# EAGLE schematic Graphics_Card_100px_x_75px (EAGLE 9.4.2)
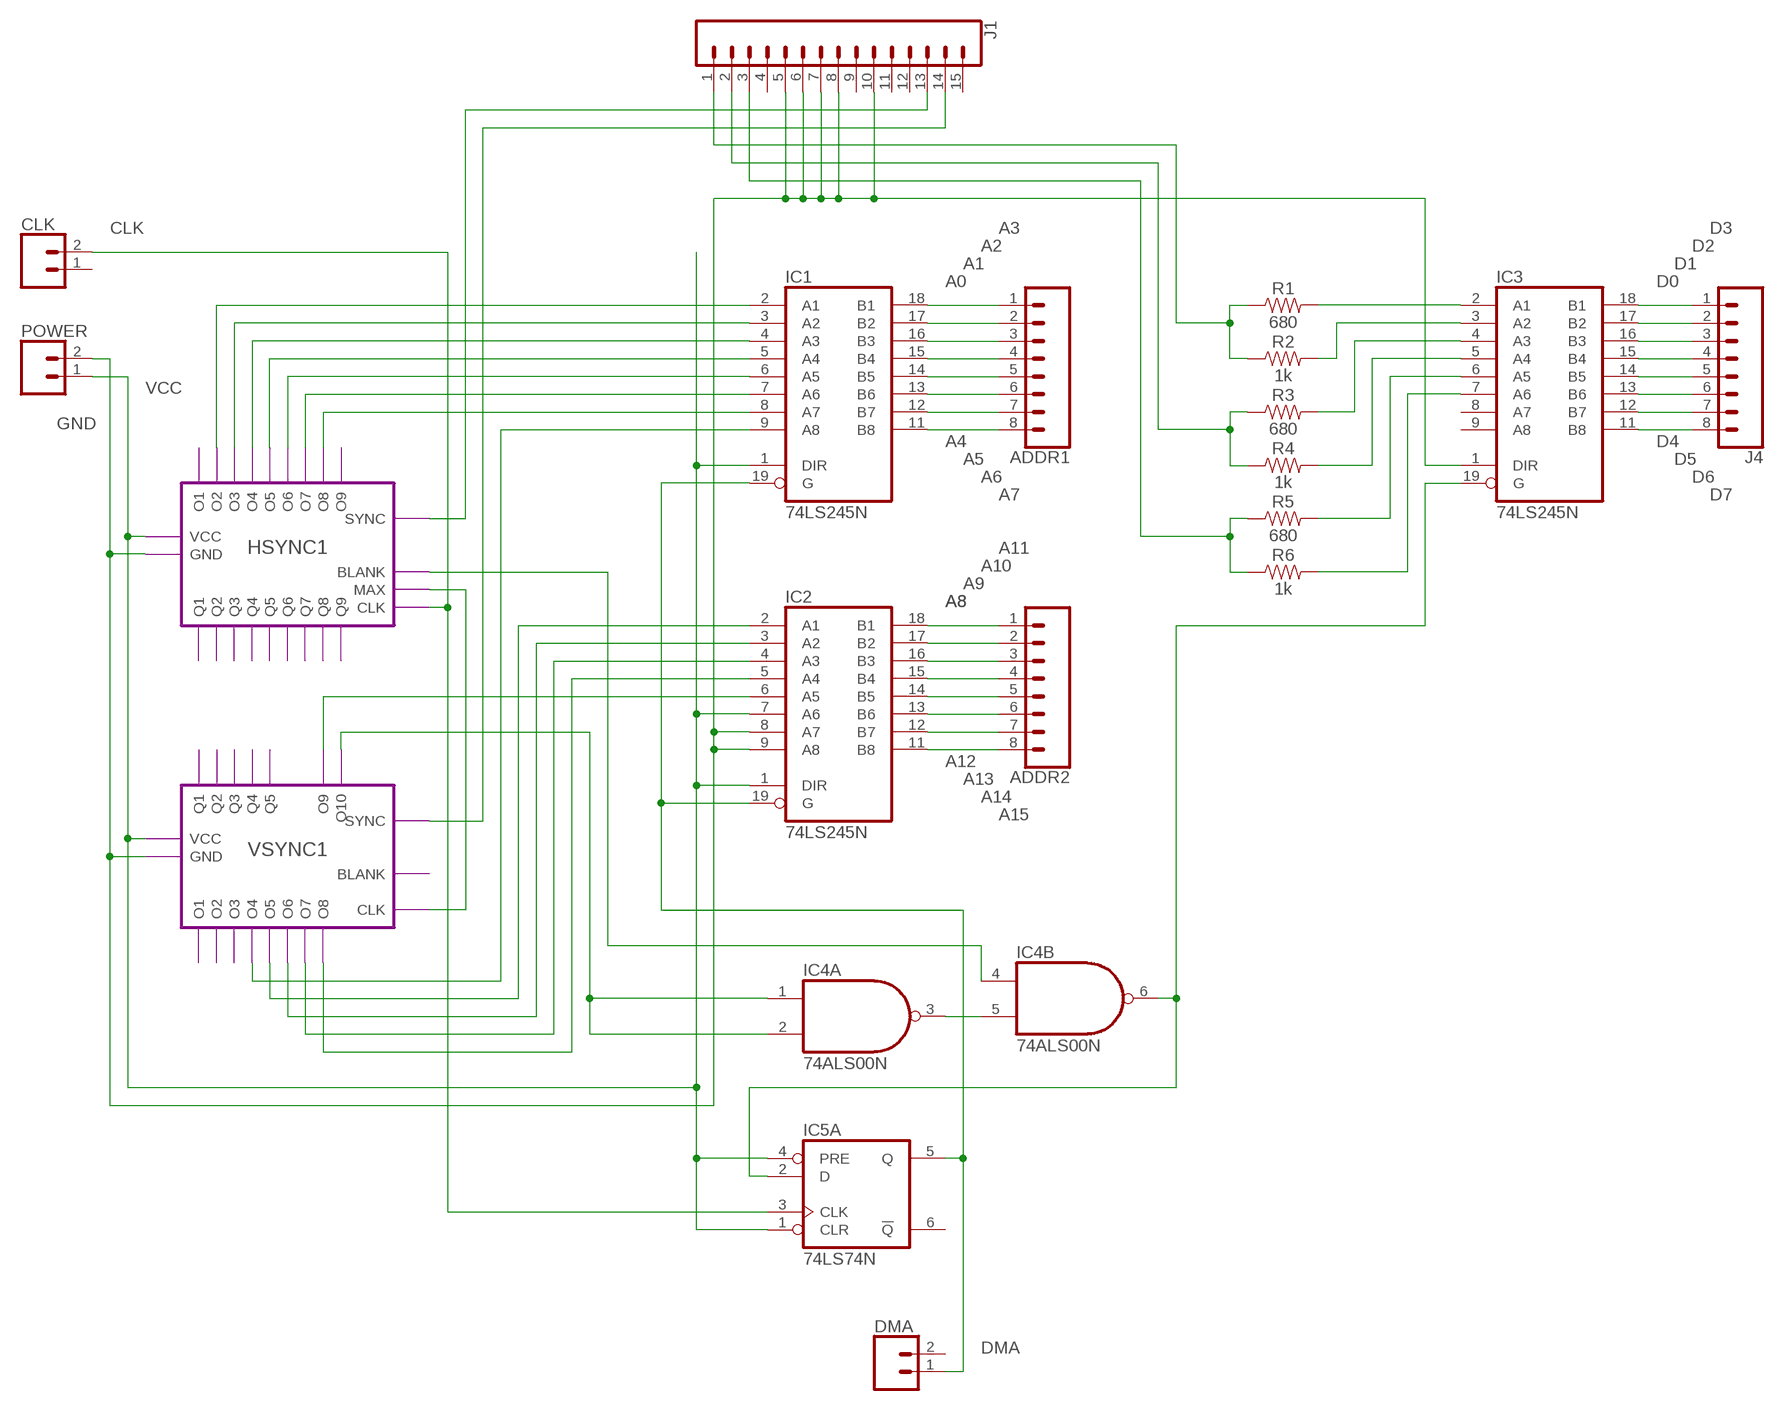
[diagram p0: schematic, sheet 1]

## Parts
ADDR1  CONN_08"  [1X08]
ADDR2  CONN_08"  [1X08]
CLK  CONN_02POGO_PIN_HOLES_ONLY  [1X02_PP_HOLES_ONLY]
DMA  CONN_02POGO_PIN_HOLES_ONLY  [1X02_PP_HOLES_ONLY]
IC1  74LS245N  [DIL20]
IC2  74LS245N  [DIL20]
IC3  74LS245N  [DIL20]
IC4  74ALS00N  [DIL14]
IC5  74LS74N  [DIL14]
J1  CONN_15  [1X15]
J4  CONN_08"  [1X08]
POWER  CONN_02POGO_PIN_HOLES_ONLY  [1X02_PP_HOLES_ONLY]
R1  680  680OHM-0603-1/10W-5%  [0603]
R2  1k  1KOHM-0603-1/10W-1%  [0603]
R3  680  680OHM-0603-1/10W-5%  [0603]
R4  1k  1KOHM-0603-1/10W-1%  [0603]
R5  680  680OHM-0603-1/10W-5%  [0603]
R6  1k  1KOHM-0603-1/10W-1%  [0603]

## Module instances
HSYNC1 = HSYNC
VSYNC1 = VSYNC

## Nets
A0: ADDR1.1 IC1.18(B1)
A1: ADDR1.2 IC1.17(B2)
A2: ADDR1.3 IC1.16(B3)
A3: ADDR1.4 IC1.15(B4)
A4: ADDR1.5 IC1.14(B5)
A5: ADDR1.6 IC1.13(B6)
A6: ADDR1.7 IC1.12(B7)
A7: ADDR1.8 IC1.11(B8)
A8: ADDR2.1 IC2.18(B1)
A9: ADDR2.2 IC2.17(B2)
A10: ADDR2.3 IC2.16(B3)
A11: ADDR2.4 IC2.15(B4)
A12: ADDR2.5 IC2.14(B5)
A13: ADDR2.6 IC2.13(B6)
A14: ADDR2.7 IC2.12(B7)
A15: ADDR2.8 IC2.11(B8)
CLK: CLK.2 IC5.3(A:CLK) ; port HSYNC1.CLK
D0: IC3.18(B1) J4.1
D1: IC3.17(B2) J4.2
D2: IC3.16(B3) J4.3
D3: IC3.15(B4) J4.4
D4: IC3.14(B5) J4.5
D5: IC3.13(B6) J4.6
D6: IC3.12(B7) J4.7
D7: IC3.11(B8) J4.8
DMA: DMA.1 IC1.19(G) IC2.19(G) IC5.5(A:Q)
GND: IC2.8(A7) IC2.9(A8) IC3.1(DIR) J1.5 J1.6 J1.7 J1.8 J1.10 POWER.2 ; port HSYNC1.GND VSYNC1.GND
N$1: IC1.2(A1) ; port HSYNC1.O2
N$2: IC3.2(A1) R1.2
N$3: IC3.3(A2) R2.2
N$4: IC1.9(A8) ; port VSYNC1.O4
N$5: IC1.3(A2) ; port HSYNC1.O3
N$6: IC1.4(A3) ; port HSYNC1.O4
N$7: IC1.5(A4) ; port HSYNC1.O5
N$8: IC1.6(A5) ; port HSYNC1.O6
N$9: IC1.7(A6) ; port HSYNC1.O7
N$10: IC1.8(A7) ; port HSYNC1.O8
N$11: IC2.2(A1) ; port VSYNC1.O5
N$12: IC2.3(A2) ; port VSYNC1.O6
N$13: IC2.4(A3) ; port VSYNC1.O7
N$14: IC2.5(A4) ; port VSYNC1.O8
N$15: IC2.6(A5) ; port VSYNC1.O9
N$17: port HSYNC1.MAX VSYNC1.CLK
N$18: IC4.1(A:I0) IC4.2(A:I1) ; port VSYNC1.O10
N$19: IC4.3(A:O) IC4.5(B:I1)
N$20: IC4.4(B:I0) ; port HSYNC1.BLANK
N$23: IC3.4(A3) R3.2
N$24: IC3.19(G) IC4.6(B:O) IC5.2(A:D)
N$25: IC3.5(A4) R4.2
N$26: IC3.6(A5) R5.2
N$27: IC3.7(A6) R6.2
VCC: IC1.1(DIR) IC2.1(DIR) IC2.7(A6) IC5.1(A:CLR) IC5.4(A:PRE) POWER.1 ; port HSYNC1.VCC VSYNC1.VCC
VG1: J1.1 R1.1 R2.1
VG2: J1.2 R3.1 R4.1
VGA3: J1.3 R5.1 R6.1
VGA14: J1.13 ; port HSYNC1.SYNC
VGA15: J1.14 ; port VSYNC1.SYNC
Unconnected: CLK.1 DMA.2 IC3.8(A7) IC3.9(A8) IC4.8(C:O) IC4.9(C:I0) IC4.10(C:I1) IC4.11(D:O) IC4.12(D:I0) IC4.13(D:I1) IC5.6(A:!Q) IC5.8(B:!Q) IC5.9(B:Q) IC5.10(B:PRE) IC5.11(B:CLK) IC5.12(B:D) IC5.13(B:CLR) J1.4 J1.9 J1.11 J1.12 J1.15

## Power pins joined to a net without a drawn wire
GND: IC1.10(GND) IC2.10(GND) IC3.10(GND) IC4.7(P:GND) IC5.7(P:GND)
VCC: IC1.20(VCC) IC2.20(VCC) IC3.20(VCC) IC4.14(P:VCC) IC5.14(P:VCC)

## Library data of the parts
ADDR1 ADDR2 J4 = SparkFun-Connectors:CONN_08: Multi connection point. Often used as Generic Header-pin footprint for 0.1 inch spaced/style header connections On any of the 0.1 inch spaced packages, you can populate with these: Break Away Headers - Straight <https://www.sparkfun.com/products/116> (PRT-00116) Break Away Male Headers - Right Angle <https://www.sparkfun.com/products/553> (PRT-00553) Female Headers <https://www.sparkfun.com/products/115> (PRT-00115) Break Away Headers - Machine Pin <https://www.sparkfun.com/products/117> (PRT-00117) Break Away Female Headers - Swiss Machine Pin <https://www.sparkfun.com/products/743> (PRT-00743) Arduino Stackable Header - 8 Pin <https://www.sparkfun.com/products/9279> (PRT-09279) For SCREWTERMINALS and SPRING TERMINALS visit here: Screw Terimnals on SparkFun.com <https://www.sparkfun.com/search/results?term=Screw+Terminals> (5mm/3.5mm/2.54mm spacing) This device is also useful as a general connection point to wire up your design to another part of your project. Our various solder wires solder well into these plated through hole pads. Hook-Up Wire - Assortment (Stranded, 22 AWG) <https://www.sparkfun.com/products/11375> (PRT-11375) Hook-Up Wire - Assortment (Solid Core, 22 AWG) <https://www.sparkfun.com/products/11367> (PRT-11367) View the entire wire category on our website here <https://www.sparkfun.com/categories/141> Special notes: Molex polarized connector foot print use with SKU : PRT-08231 with associated crimp pins and housings. 1MM SMD Version SKU: PRT-10208 NOTES ON THE VARIANTS LOCK and LOCK_LONGPADS... This footprint was designed to help hold the alignment of a through-hole component (i.e. 6-pin header) while soldering it into place. You may notice that each hole has been shifted either up or down by 0.005 of an inch from it's more standard position (which is a perfectly straight line). This slight alteration caused the pins (the squares in the middle) to touch the edges of the holes. Because they are alternating, it causes a "brace" to hold the component in place. 0.005 has proven to be the perfect amount of "off-center" position when using our standard breakaway headers. Although looks a little odd when you look at the bare footprint, once you have a header in there, the alteration is very hard to notice. Also,if you push a header all the way into place, it is covered up entirely on the bottom side.; PROD_ID: CONN-08438
CLK DMA POWER = SparkFun-Connectors:CONN_02: Multi connection point. Often used as Generic Header-pin footprint for 0.1 inch spaced/style header connections On any of the 0.1 inch spaced packages, you can populate with these: Break Away Headers - Straight <https://www.sparkfun.com/products/116> (PRT-00116) Break Away Male Headers - Right Angle <https://www.sparkfun.com/products/553> (PRT-00553) Female Headers <https://www.sparkfun.com/products/115> (PRT-00115) Break Away Headers - Machine Pin <https://www.sparkfun.com/products/117> (PRT-00117) Break Away Female Headers - Swiss Machine Pin <https://www.sparkfun.com/products/743> (PRT-00743) For SCREWTERMINALS and SPRING TERMINALS visit here: Screw Terimnals on SparkFun.com <https://www.sparkfun.com/search/results?term=Screw+Terminals> (5mm/3.5mm/2.54mm spacing) This device is also useful as a general connection point to wire up your design to another part of your project. Our various solder wires solder well into these plated through hole pads. Hook-Up Wire - Assortment (Stranded, 22 AWG) <https://www.sparkfun.com/products/11375> (PRT-11375) Hook-Up Wire - Assortment (Solid Core, 22 AWG) <https://www.sparkfun.com/products/11367> (PRT-11367) View the entire wire category on our website here <https://www.sparkfun.com/categories/141> Special notes: Molex polarized connector foot print use with: PRT-08233 with associated crimp pins and housings. 2.54_SCREWTERM for use with PRT-10571. 3.5mm Screw Terminal footprints for PRT-08084 5mm Screw Terminal footprints for use with PRT-08432
IC1-IC3 = 74xx-us:74*245: Octal BUS TRANSCEIVER, 3-state
IC4 = 74xx-us:74*00: Quad 2-input NAND gate
IC5 = 74xx-us:74*74: Dual D type positive edge triggered FLIP FLOP, preset and clear
J1 = SparkFun-Connectors:CONN_15: Multi connection point. Often used as Generic Header-pin footprint for 0.1 inch spaced/style header connections On any of the 0.1 inch spaced packages, you can populate with these: Break Away Headers - Straight <https://www.sparkfun.com/products/116> (PRT-00116) Break Away Male Headers - Right Angle <https://www.sparkfun.com/products/553> (PRT-00553) Female Headers <https://www.sparkfun.com/products/115> (PRT-00115) Break Away Headers - Machine Pin <https://www.sparkfun.com/products/117> (PRT-00117) Break Away Female Headers - Swiss Machine Pin <https://www.sparkfun.com/products/743> (PRT-00743) For SCREWTERMINALS and SPRING TERMINALS visit here: Screw Terimnals on SparkFun.com <https://www.sparkfun.com/search/results?term=Screw+Terminals> (5mm/3.5mm/2.54mm spacing) This device is also useful as a general connection point to wire up your design to another part of your project. Our various solder wires solder well into these plated through hole pads. Hook-Up Wire - Assortment (Stranded, 22 AWG) <https://www.sparkfun.com/products/11375> (PRT-11375) Hook-Up Wire - Assortment (Solid Core, 22 AWG) <https://www.sparkfun.com/products/11367> (PRT-11367) View the entire wire category on our website here <https://www.sparkfun.com/categories/141> Special notes: Molex polarized connector foot print use with SKU : PRT-08231 with associated crimp pins and housings. 1MM SMD Version SKU: PRT-10208 NOTES ON THE VARIANTS LOCK and LOCK_LONGPADS... This footprint was designed to help hold the alignment of a through-hole component (i.e. 6-pin header) while soldering it into place. You may notice that each hole has been shifted either up or down by 0.005 of an inch from it's more standard position (which is a perfectly straight line). This slight alteration caused the pins (the squares in the middle) to touch the edges of the holes. Because they are alternating, it causes a "brace" to hold the component in place. 0.005 has proven to be the perfect amount of "off-center" position when using our standard breakaway headers. Although looks a little odd when you look at the bare footprint, once you have a header in there, the alteration is very hard to notice. Also,if you push a header all the way into place, it is covered up entirely on the bottom side.
R1 R3 R5 = SparkFun-Resistors:680OHM: 680Ω resistor A resistor is a passive two-terminal electrical component that implements electrical resistance as a circuit element. Resistors act to reduce current flow, and, at the same time, act to lower voltage levels within circuits. - Wikipedia; PROD_ID: RES-09333
R2 R4 R6 = SparkFun-Resistors:1KOHM: 1kΩ resistor A resistor is a passive two-terminal electrical component that implements electrical resistance as a circuit element. Resistors act to reduce current flow, and, at the same time, act to lower voltage levels within circuits. - Wikipedia; PROD_ID: RES-07856

## Module HSYNC
Ports: SYNC(io) BLANK(io) CLK(io) MAX(io) VCC(io) GND(io) Q1(io) Q2(io) Q3(io) Q4(io) Q5(io) Q6(io) Q7(io) Q8(io) Q9(io) O1(io) O2(io) O3(io) O4(io) O5(io) O6(io) O7(io) O8(io) O9(io)
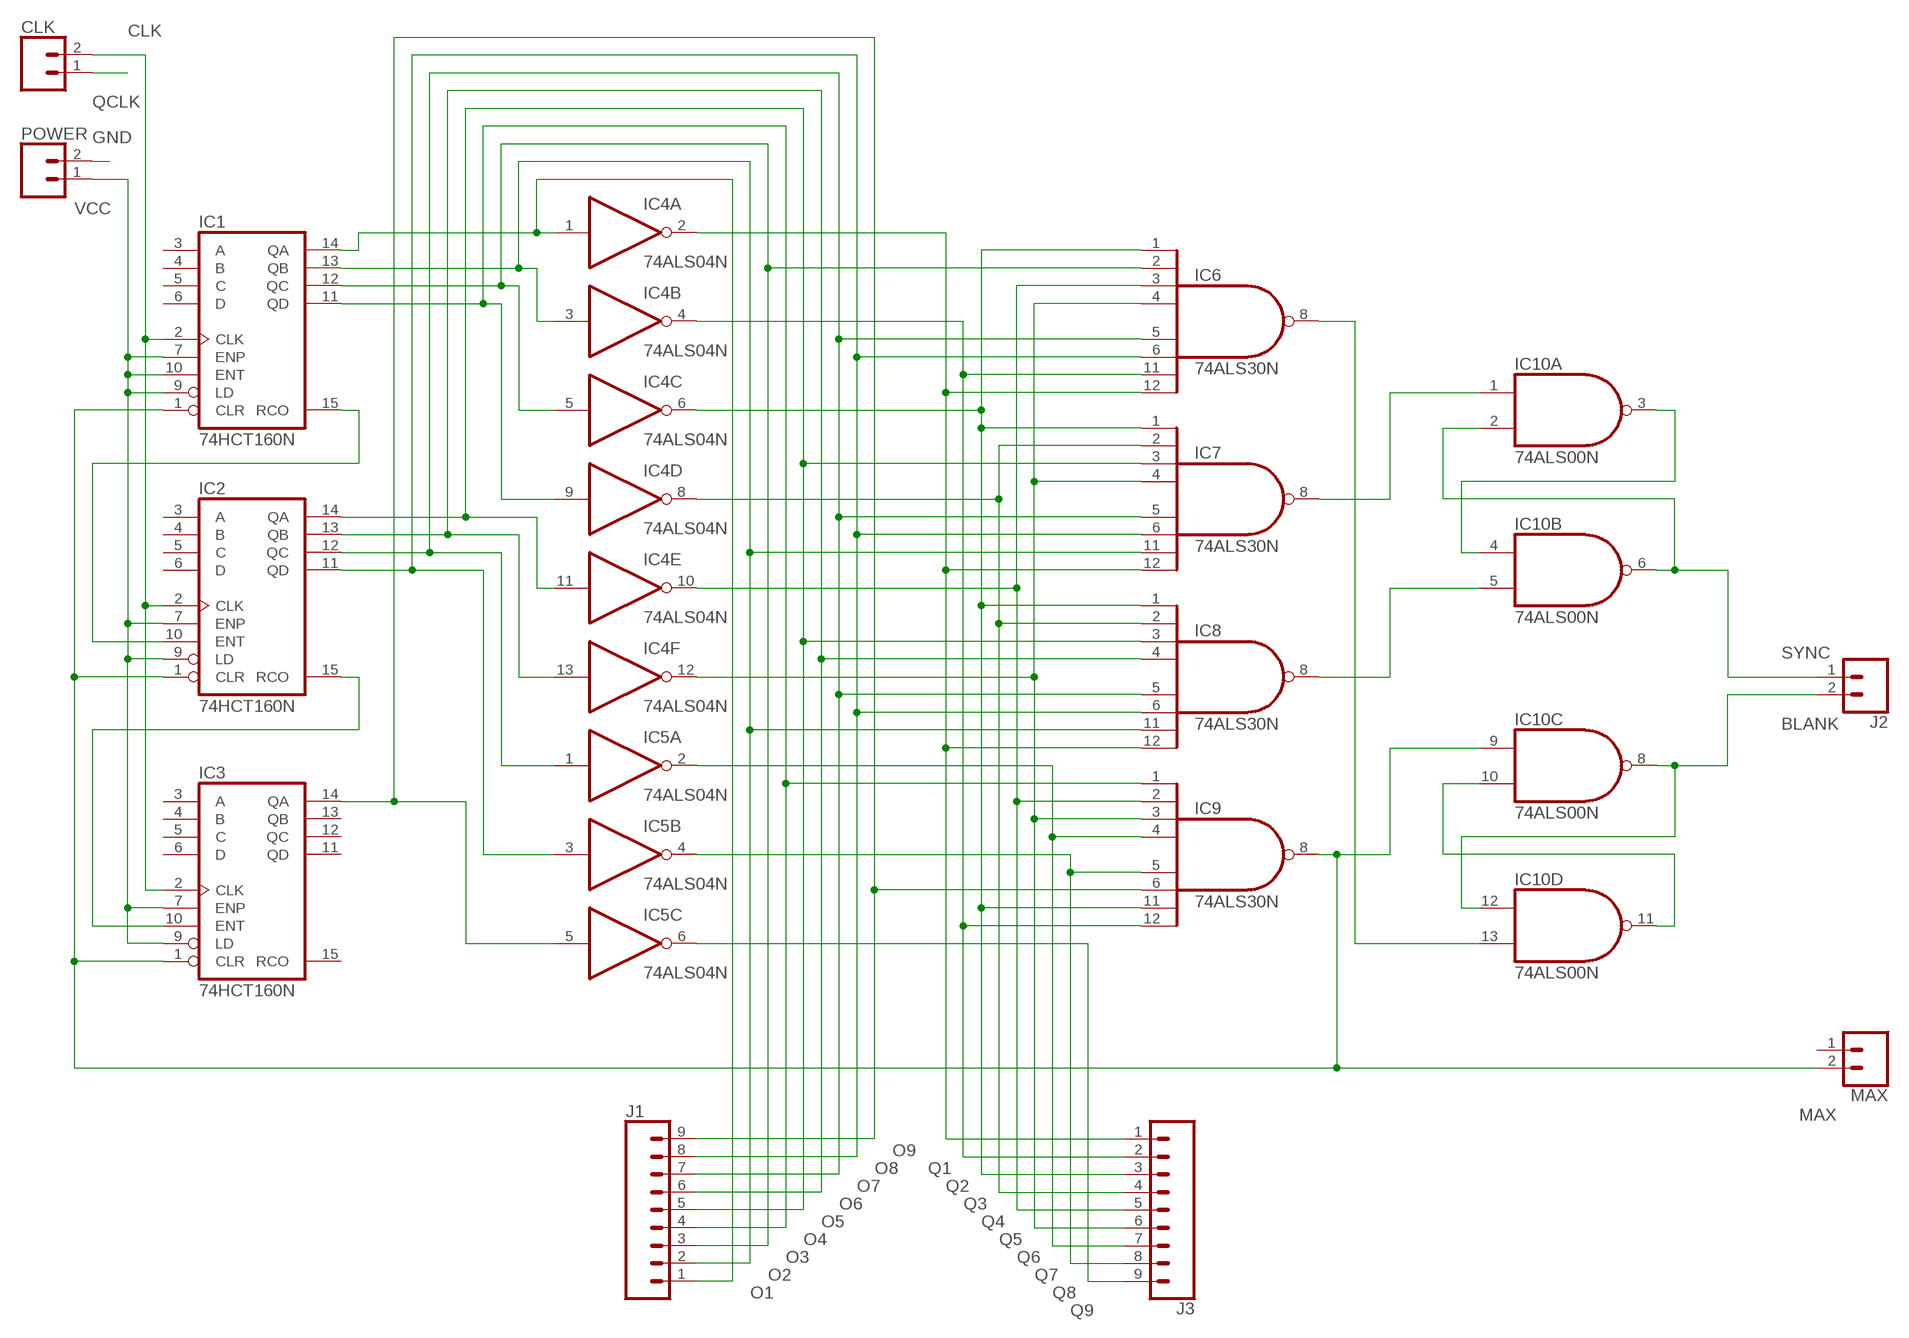
[diagram p1: schematic, module HSYNC, sheet 1]

### Parts
CLK  CONN_02POGO_PIN_HOLES_ONLY  [1X02_PP_HOLES_ONLY]
IC1  74HCT160N  [DIL16]
IC2  74HCT160N  [DIL16]
IC3  74HCT160N  [DIL16]
IC4  74ALS04N  [DIL14]
IC5  74ALS04N  [DIL14]
IC6  74ALS30N  [DIL14]
IC7  74ALS30N  [DIL14]
IC8  74ALS30N  [DIL14]
IC9  74ALS30N  [DIL14]
IC10  74ALS00N  [DIL14]
J1  CONN_09  [1X09]
J2  CONN_02POGO_PIN_HOLES_ONLY  [1X02_PP_HOLES_ONLY]
J3  CONN_09  [1X09]
MAX  CONN_02POGO_PIN_HOLES_ONLY  [1X02_PP_HOLES_ONLY]
POWER  CONN_02POGO_PIN_HOLES_ONLY  [1X02_PP_HOLES_ONLY]

### Nets
BLANK: IC10.8(C:O) IC10.12(D:I0) J2.2
CLK: CLK.2 IC1.2(CLK) IC2.2(CLK) IC3.2(CLK)
GND: POWER.2
MAX: IC1.1(CLR) IC2.1(CLR) IC3.1(CLR) IC9.8(O) IC10.9(C:I0) MAX.2
N$3: IC1.15(RCO) IC2.10(ENT)
N$4: IC2.15(RCO) IC3.10(ENT)
N$24: IC7.8(O) IC10.1(A:I0)
N$25: IC8.8(O) IC10.5(B:I1)
N$26: IC10.3(A:O) IC10.4(B:I0)
N$28: IC6.8(O) IC10.13(D:I1)
N$32: IC10.10(C:I1) IC10.11(D:O)
O1: IC1.14(QA) IC4.1(A:I) J1.1
O2: IC1.13(QB) IC4.3(B:I) IC7.11(I6) IC8.11(I6) J1.2
O3: IC1.12(QC) IC4.5(C:I) IC6.2(I1) J1.3
O4: IC1.11(QD) IC4.9(D:I) IC9.1(I0) J1.4
O5: IC2.14(QA) IC4.11(E:I) IC7.3(I2) IC8.3(I2) J1.5
O6: IC2.13(QB) IC4.13(F:I) IC8.4(I3) J1.6
O7: IC2.12(QC) IC5.1(A:I) IC6.5(I4) IC7.5(I4) IC8.5(I4) J1.7
O8: IC2.11(QD) IC5.3(B:I) IC6.6(I5) IC7.6(I5) IC8.6(I5) J1.8
O9: IC3.14(QA) IC5.5(C:I) IC9.6(I5) J1.9
Q1: IC4.2(A:O) IC6.12(I7) IC7.12(I7) IC8.12(I7) J3.1
Q2: IC4.4(B:O) IC6.11(I6) IC9.12(I7) J3.2
Q3: IC4.6(C:O) IC6.1(I0) IC7.1(I0) IC8.1(I0) IC9.11(I6) J3.3
Q4: IC4.8(D:O) IC7.2(I1) IC8.2(I1) J3.4
Q5: IC4.10(E:O) IC6.3(I2) IC9.2(I1) J3.5
Q6: IC4.12(F:O) IC6.4(I3) IC7.4(I3) IC9.3(I2) J3.6
Q7: IC5.2(A:O) IC9.4(I3) J3.7
Q8: IC5.4(B:O) IC9.5(I4) J3.8
Q9: IC5.6(C:O) J3.9
QCLK: CLK.1
SYNC: IC10.2(A:I1) IC10.6(B:O) J2.1
VCC: IC1.7(ENP) IC1.9(LD) IC1.10(ENT) IC2.7(ENP) IC2.9(LD) IC3.7(ENP) IC3.9(LD) POWER.1
Unconnected: IC1.3(A) IC1.4(B) IC1.5(C) IC1.6(D) IC2.3(A) IC2.4(B) IC2.5(C) IC2.6(D) IC3.3(A) IC3.4(B) IC3.5(C) IC3.6(D) IC3.11(QD) IC3.12(QC) IC3.13(QB) IC3.15(RCO) IC5.8(D:O) IC5.9(D:I) IC5.10(E:O) IC5.11(E:I) IC5.12(F:O) IC5.13(F:I) MAX.1

### Power pins joined to a net without a drawn wire
GND: IC1.8(GND) IC2.8(GND) IC3.8(GND) IC4.7(P:GND) IC5.7(P:GND) IC6.7(GND) IC7.7(GND) IC8.7(GND) IC9.7(GND) IC10.7(P:GND)
VCC: IC1.16(VCC) IC2.16(VCC) IC3.16(VCC) IC4.14(P:VCC) IC5.14(P:VCC) IC6.14(VCC) IC7.14(VCC) IC8.14(VCC) IC9.14(VCC) IC10.14(P:VCC)

### Library data of the parts
CLK J2 MAX POWER = SparkFun-Connectors:CONN_02: Multi connection point. Often used as Generic Header-pin footprint for 0.1 inch spaced/style header connections On any of the 0.1 inch spaced packages, you can populate with these: Break Away Headers - Straight <https://www.sparkfun.com/products/116> (PRT-00116) Break Away Male Headers - Right Angle <https://www.sparkfun.com/products/553> (PRT-00553) Female Headers <https://www.sparkfun.com/products/115> (PRT-00115) Break Away Headers - Machine Pin <https://www.sparkfun.com/products/117> (PRT-00117) Break Away Female Headers - Swiss Machine Pin <https://www.sparkfun.com/products/743> (PRT-00743) For SCREWTERMINALS and SPRING TERMINALS visit here: Screw Terimnals on SparkFun.com <https://www.sparkfun.com/search/results?term=Screw+Terminals> (5mm/3.5mm/2.54mm spacing) This device is also useful as a general connection point to wire up your design to another part of your project. Our various solder wires solder well into these plated through hole pads. Hook-Up Wire - Assortment (Stranded, 22 AWG) <https://www.sparkfun.com/products/11375> (PRT-11375) Hook-Up Wire - Assortment (Solid Core, 22 AWG) <https://www.sparkfun.com/products/11367> (PRT-11367) View the entire wire category on our website here <https://www.sparkfun.com/categories/141> Special notes: Molex polarized connector foot print use with: PRT-08233 with associated crimp pins and housings. 2.54_SCREWTERM for use with PRT-10571. 3.5mm Screw Terminal footprints for PRT-08084 5mm Screw Terminal footprints for use with PRT-08432
IC1-IC3 = 74xx-eu:74*160: Synchronous 4-bit COUNTER
IC4 IC5 = 74xx-us:74*04: Hex INVERTER
IC6-IC9 = 74xx-us:74*30: 8-input NAND gate
IC10 = 74xx-us:74*00: Quad 2-input NAND gate
J1 J3 = SparkFun-Connectors:CONN_09: Multi connection point. Often used as Generic Header-pin footprint for 0.1 inch spaced/style header connections On any of the 0.1 inch spaced packages, you can populate with these: Break Away Headers - Straight <https://www.sparkfun.com/products/116> (PRT-00116) Break Away Male Headers - Right Angle <https://www.sparkfun.com/products/553> (PRT-00553) Female Headers <https://www.sparkfun.com/products/115> (PRT-00115) Break Away Headers - Machine Pin <https://www.sparkfun.com/products/117> (PRT-00117) Break Away Female Headers - Swiss Machine Pin <https://www.sparkfun.com/products/743> (PRT-00743) For SCREWTERMINALS and SPRING TERMINALS visit here: Screw Terimnals on SparkFun.com <https://www.sparkfun.com/search/results?term=Screw+Terminals> (5mm/3.5mm/2.54mm spacing) This device is also useful as a general connection point to wire up your design to another part of your project. Our various solder wires solder well into these plated through hole pads. Hook-Up Wire - Assortment (Stranded, 22 AWG) <https://www.sparkfun.com/products/11375> (PRT-11375) Hook-Up Wire - Assortment (Solid Core, 22 AWG) <https://www.sparkfun.com/products/11367> (PRT-11367) View the entire wire category on our website here <https://www.sparkfun.com/categories/141> Special notes: Molex polarized connector foot print use with SKU : PRT-08231 with associated crimp pins and housings. 1MM SMD Version SKU: PRT-10208 NOTES ON THE VARIANTS LOCK and LOCK_LONGPADS... This footprint was designed to help hold the alignment of a through-hole component (i.e. 6-pin header) while soldering it into place. You may notice that each hole has been shifted either up or down by 0.005 of an inch from it's more standard position (which is a perfectly straight line). This slight alteration caused the pins (the squares in the middle) to touch the edges of the holes. Because they are alternating, it causes a "brace" to hold the component in place. 0.005 has proven to be the perfect amount of "off-center" position when using our standard breakaway headers. Although looks a little odd when you look at the bare footprint, once you have a header in there, the alteration is very hard to notice. Also,if you push a header all the way into place, it is covered up entirely on the bottom side.

## Module VSYNC
Ports: SYNC(io) BLANK(io) CLK(io) VCC(io) GND(io) Q1(io) Q2(io) Q3(io) Q4(io) Q5(io) O1(io) O2(io) O3(io) O4(io) O5(io) O6(io) O7(io) O8(io) O9(io) O10(io)
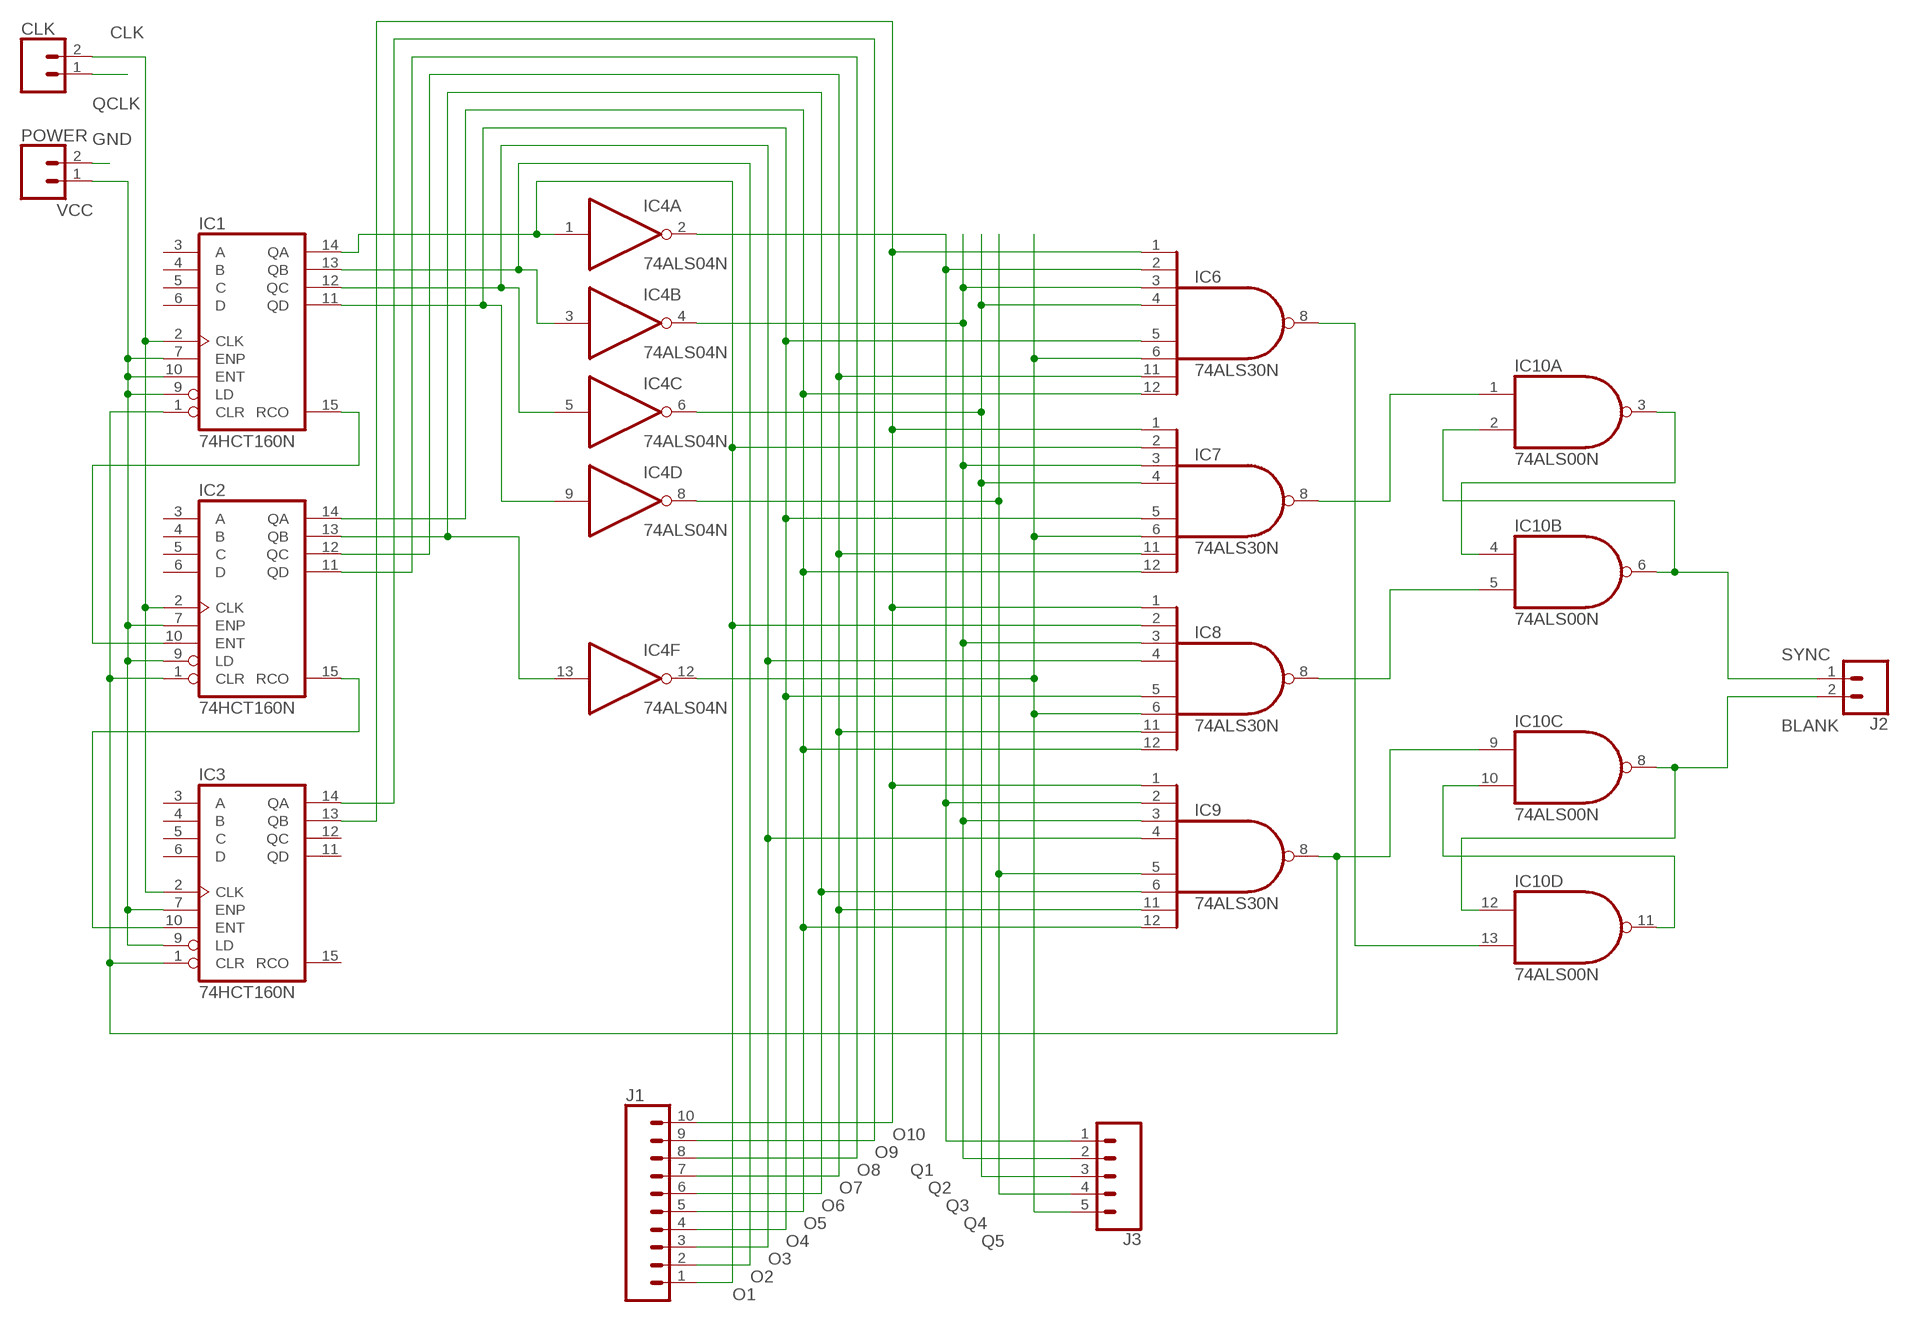
[diagram p2: schematic, module VSYNC, sheet 1]

### Parts
CLK  CONN_02POGO_PIN_HOLES_ONLY  [1X02_PP_HOLES_ONLY]
IC1  74HCT160N  [DIL16]
IC2  74HCT160N  [DIL16]
IC3  74HCT160N  [DIL16]
IC4  74ALS04N  [DIL14]
IC6  74ALS30N  [DIL14]
IC7  74ALS30N  [DIL14]
IC8  74ALS30N  [DIL14]
IC9  74ALS30N  [DIL14]
IC10  74ALS00N  [DIL14]
J1  CONN_10"  [1X10]
J2  CONN_02POGO_PIN_HOLES_ONLY  [1X02_PP_HOLES_ONLY]
J3  CONN_05  [1X05]
POWER  CONN_02POGO_PIN_HOLES_ONLY  [1X02_PP_HOLES_ONLY]

### Nets
BLANK: IC10.8(C:O) IC10.12(D:I0) J2.2
CLK: CLK.2 IC1.2(CLK) IC2.2(CLK) IC3.2(CLK)
CLR: IC1.1(CLR) IC2.1(CLR) IC3.1(CLR) IC9.8(O) IC10.9(C:I0)
GND: POWER.2
N$3: IC1.15(RCO) IC2.10(ENT)
N$4: IC2.15(RCO) IC3.10(ENT)
N$24: IC7.8(O) IC10.1(A:I0)
N$25: IC8.8(O) IC10.5(B:I1)
N$26: IC10.3(A:O) IC10.4(B:I0)
N$28: IC6.8(O) IC10.13(D:I1)
N$32: IC10.10(C:I1) IC10.11(D:O)
O1: IC1.14(QA) IC4.1(A:I) IC7.2(I1) IC8.2(I1) J1.1
O2: IC1.13(QB) IC4.3(B:I) J1.2
O3: IC1.12(QC) IC4.5(C:I) IC8.4(I3) IC9.4(I3) J1.3
O4: IC1.11(QD) IC4.9(D:I) IC6.5(I4) IC7.5(I4) IC8.5(I4) J1.4
O5: IC2.14(QA) IC6.12(I7) IC7.12(I7) IC8.12(I7) IC9.12(I7) J1.5
O6: IC2.13(QB) IC4.13(F:I) IC9.6(I5) J1.6
O7: IC2.12(QC) IC6.11(I6) IC7.11(I6) IC8.11(I6) IC9.11(I6) J1.7
O8: IC2.11(QD) J1.8
O9: IC3.14(QA) J1.9
O10: IC3.13(QB) IC6.1(I0) IC7.1(I0) IC8.1(I0) IC9.1(I0) J1.10
Q1: IC4.2(A:O) IC6.2(I1) IC9.2(I1) J3.1
Q2: IC4.4(B:O) IC6.3(I2) IC7.3(I2) IC8.3(I2) IC9.3(I2) J3.2
Q3: IC4.6(C:O) IC6.4(I3) IC7.4(I3) J3.3
Q4: IC4.8(D:O) IC9.5(I4) J3.4
Q5: IC4.12(F:O) IC6.6(I5) IC7.6(I5) IC8.6(I5) J3.5
QCLK: CLK.1
SYNC: IC10.2(A:I1) IC10.6(B:O) J2.1
VCC: IC1.7(ENP) IC1.9(LD) IC1.10(ENT) IC2.7(ENP) IC2.9(LD) IC3.7(ENP) IC3.9(LD) POWER.1
Unconnected: IC1.3(A) IC1.4(B) IC1.5(C) IC1.6(D) IC2.3(A) IC2.4(B) IC2.5(C) IC2.6(D) IC3.3(A) IC3.4(B) IC3.5(C) IC3.6(D) IC3.11(QD) IC3.12(QC) IC3.15(RCO) IC4.10(E:O) IC4.11(E:I)

### Power pins joined to a net without a drawn wire
GND: IC1.8(GND) IC2.8(GND) IC3.8(GND) IC4.7(P:GND) IC6.7(GND) IC7.7(GND) IC8.7(GND) IC9.7(GND) IC10.7(P:GND)
VCC: IC1.16(VCC) IC2.16(VCC) IC3.16(VCC) IC4.14(P:VCC) IC6.14(VCC) IC7.14(VCC) IC8.14(VCC) IC9.14(VCC) IC10.14(P:VCC)

### Library data of the parts
CLK J2 POWER = SparkFun-Connectors:CONN_02: Multi connection point. Often used as Generic Header-pin footprint for 0.1 inch spaced/style header connections On any of the 0.1 inch spaced packages, you can populate with these: Break Away Headers - Straight <https://www.sparkfun.com/products/116> (PRT-00116) Break Away Male Headers - Right Angle <https://www.sparkfun.com/products/553> (PRT-00553) Female Headers <https://www.sparkfun.com/products/115> (PRT-00115) Break Away Headers - Machine Pin <https://www.sparkfun.com/products/117> (PRT-00117) Break Away Female Headers - Swiss Machine Pin <https://www.sparkfun.com/products/743> (PRT-00743) For SCREWTERMINALS and SPRING TERMINALS visit here: Screw Terimnals on SparkFun.com <https://www.sparkfun.com/search/results?term=Screw+Terminals> (5mm/3.5mm/2.54mm spacing) This device is also useful as a general connection point to wire up your design to another part of your project. Our various solder wires solder well into these plated through hole pads. Hook-Up Wire - Assortment (Stranded, 22 AWG) <https://www.sparkfun.com/products/11375> (PRT-11375) Hook-Up Wire - Assortment (Solid Core, 22 AWG) <https://www.sparkfun.com/products/11367> (PRT-11367) View the entire wire category on our website here <https://www.sparkfun.com/categories/141> Special notes: Molex polarized connector foot print use with: PRT-08233 with associated crimp pins and housings. 2.54_SCREWTERM for use with PRT-10571. 3.5mm Screw Terminal footprints for PRT-08084 5mm Screw Terminal footprints for use with PRT-08432
IC1-IC3 = 74xx-eu:74*160: Synchronous 4-bit COUNTER
IC4 = 74xx-us:74*04: Hex INVERTER
IC6-IC9 = 74xx-us:74*30: 8-input NAND gate
IC10 = 74xx-us:74*00: Quad 2-input NAND gate
J1 = SparkFun-Connectors:CONN_10: Multi connection point. Often used as Generic Header-pin footprint for 0.1 inch spaced/style header connections On any of the 0.1 inch spaced packages, you can populate with these: Break Away Headers - Straight <https://www.sparkfun.com/products/116> (PRT-00116) Break Away Male Headers - Right Angle <https://www.sparkfun.com/products/553> (PRT-00553) Female Headers <https://www.sparkfun.com/products/115> (PRT-00115) Break Away Headers - Machine Pin <https://www.sparkfun.com/products/117> (PRT-00117) Break Away Female Headers - Swiss Machine Pin <https://www.sparkfun.com/products/743> (PRT-00743) Arduino Stackable Header - 10 Pin <https://www.sparkfun.com/products/11376> (PRT-11376) For SCREWTERMINALS and SPRING TERMINALS visit here: Screw Terimnals on SparkFun.com <https://www.sparkfun.com/search/results?term=Screw+Terminals> (5mm/3.5mm/2.54mm spacing) This device is also useful as a general connection point to wire up your design to another part of your project. Our various solder wires solder well into these plated through hole pads. Hook-Up Wire - Assortment (Stranded, 22 AWG) <https://www.sparkfun.com/products/11375> (PRT-11375) Hook-Up Wire - Assortment (Solid Core, 22 AWG) <https://www.sparkfun.com/products/11367> (PRT-11367) View the entire wire category on our website here <https://www.sparkfun.com/categories/141> Special notes: Molex polarized connector foot print use with SKU : PRT-08231 with associated crimp pins and housings. 1MM SMD Version SKU: PRT-10208 NOTES ON THE VARIANTS LOCK and LOCK_LONGPADS... This footprint was designed to help hold the alignment of a through-hole component (i.e. 6-pin header) while soldering it into place. You may notice that each hole has been shifted either up or down by 0.005 of an inch from it's more standard position (which is a perfectly straight line). This slight alteration caused the pins (the squares in the middle) to touch the edges of the holes. Because they are alternating, it causes a "brace" to hold the component in place. 0.005 has proven to be the perfect amount of "off-center" position when using our standard breakaway headers. Although looks a little odd when you look at the bare footprint, once you have a header in there, the alteration is very hard to notice. Also,if you push a header all the way into place, it is covered up entirely on the bottom side.; PROD_ID: CONN-11563
J3 = SparkFun-Connectors:CONN_05: Multi connection point. Often used as Generic Header-pin footprint for 0.1 inch spaced/style header connections On any of the 0.1 inch spaced packages, you can populate with these: Break Away Headers - Straight <https://www.sparkfun.com/products/116> (PRT-00116) Break Away Male Headers - Right Angle <https://www.sparkfun.com/products/553> (PRT-00553) Female Headers <https://www.sparkfun.com/products/115> (PRT-00115) Break Away Headers - Machine Pin <https://www.sparkfun.com/products/117> (PRT-00117) Break Away Female Headers - Swiss Machine Pin <https://www.sparkfun.com/products/743> (PRT-00743) For SCREWTERMINALS and SPRING TERMINALS visit here: Screw Terimnals on SparkFun.com <https://www.sparkfun.com/search/results?term=Screw+Terminals> (5mm/3.5mm/2.54mm spacing) This device is also useful as a general connection point to wire up your design to another part of your project. Our various solder wires solder well into these plated through hole pads. Hook-Up Wire - Assortment (Stranded, 22 AWG) <https://www.sparkfun.com/products/11375> (PRT-11375) Hook-Up Wire - Assortment (Solid Core, 22 AWG) <https://www.sparkfun.com/products/11367> (PRT-11367) View the entire wire category on our website here <https://www.sparkfun.com/categories/141> Special notes: Molex polarized connector foot print use with SKU : PRT-08231 with associated crimp pins and housings. 1MM SMD Version SKU: PRT-10208